# EAGLE design LVDS Raspi V0 (EAGLE 9.1.1)
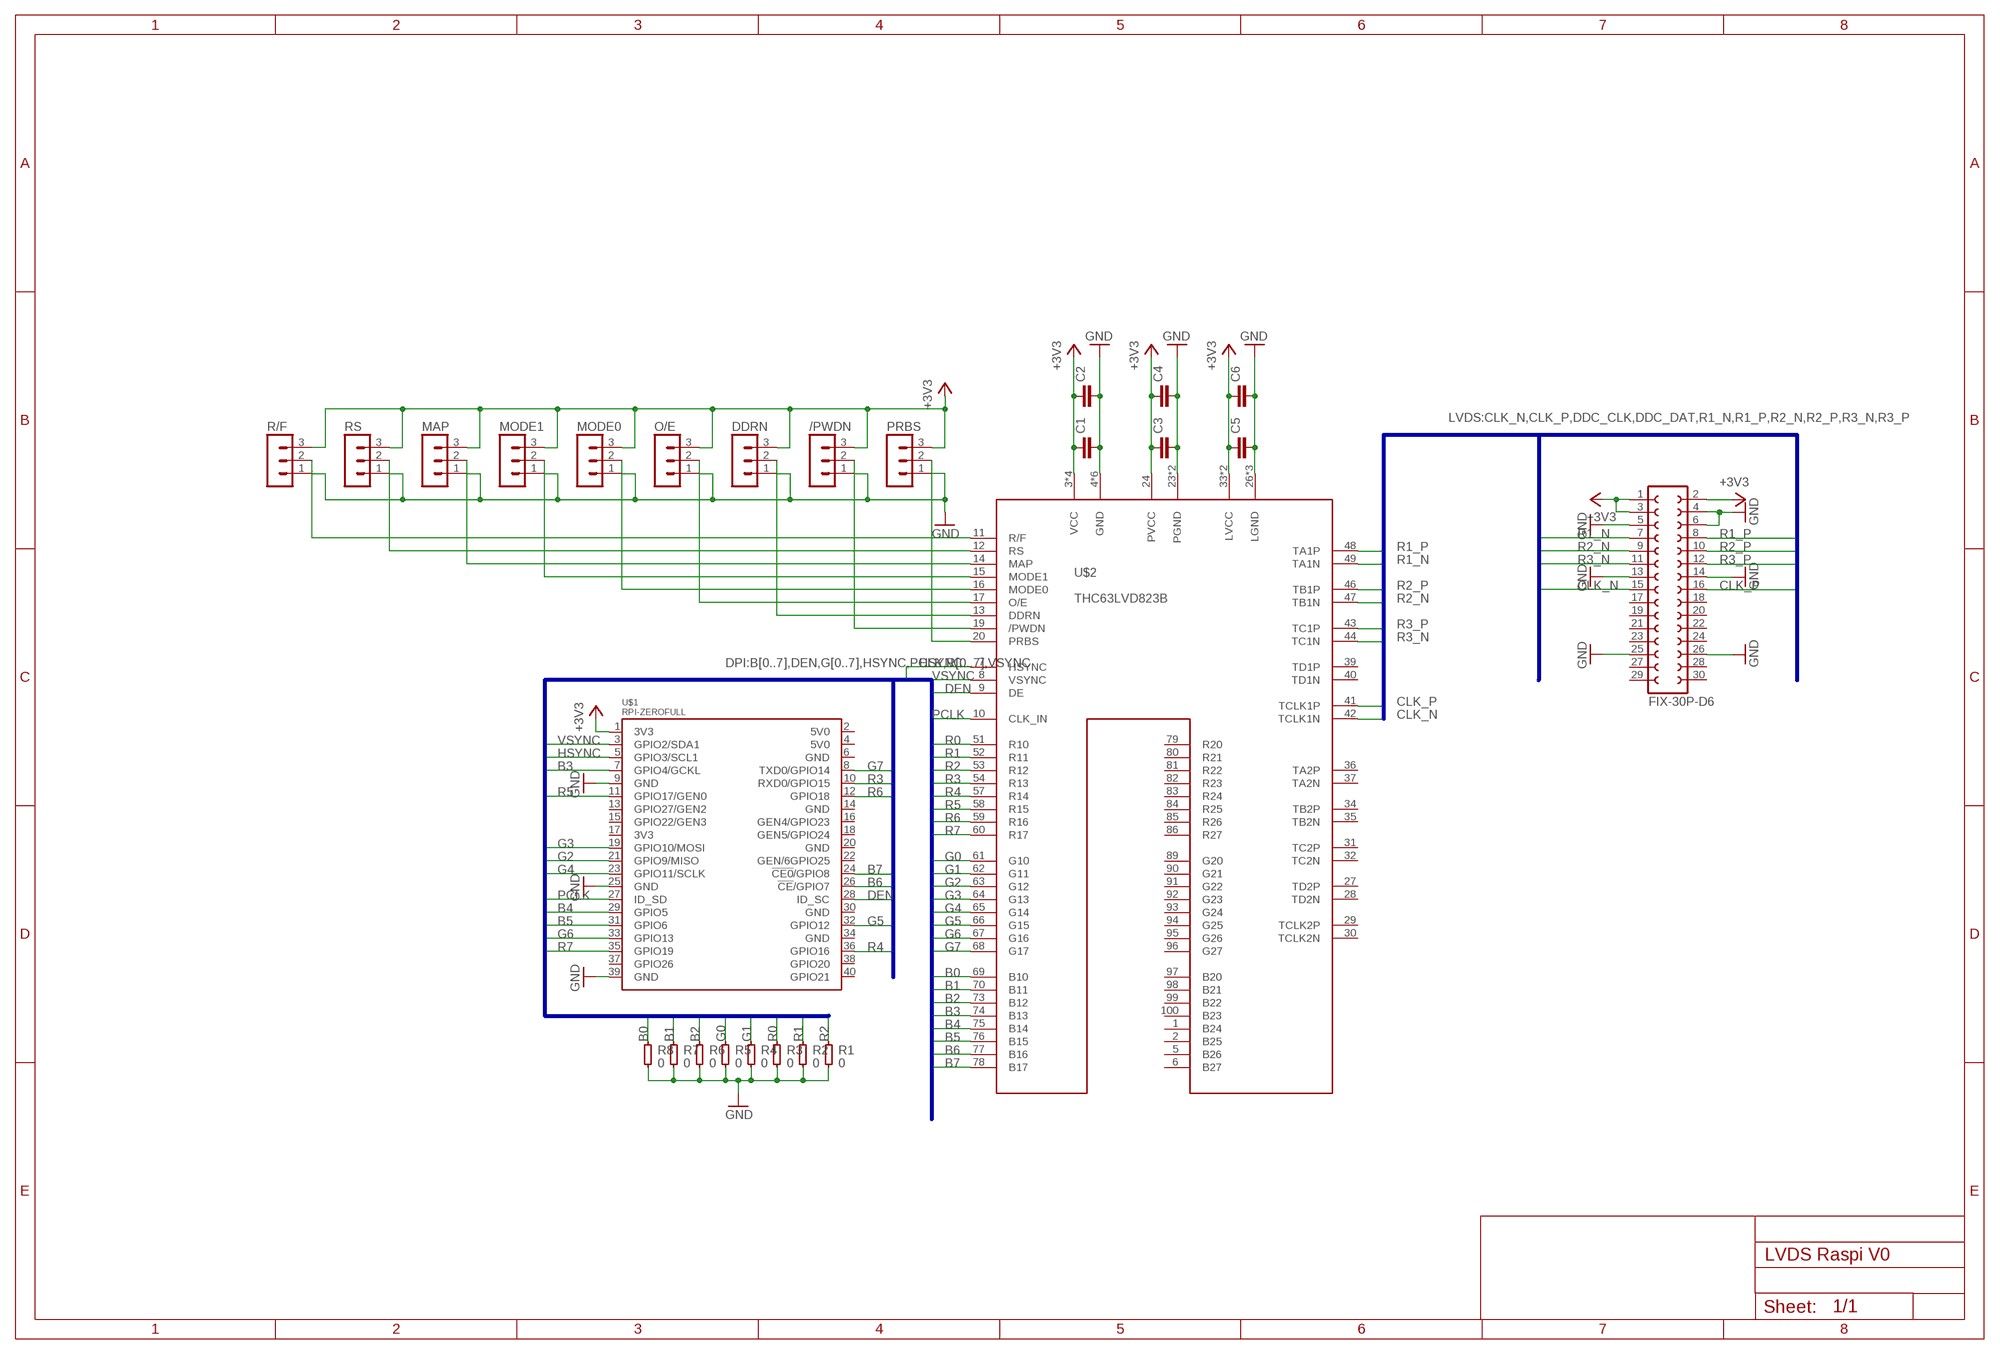
[diagram p0: schematic, sheet 1]

## Parts
/PWDN  MA03-1  [MA03-1]
C1  C0603  [C0603]
C2  C0603  [C0603]
C3  C0603  [C0603]
C4  C0603  [C0603]
C5  C0603  [C0603]
C6  C0603  [C0603]
DDRN  MA03-1  [MA03-1]
FIX-30P-D6  FE15-2  [FE15-2]
MAP  MA03-1  [MA03-1]
MODE0  MA03-1  [MA03-1]
MODE1  MA03-1  [MA03-1]
O/E  MA03-1  [MA03-1]
PRBS  MA03-1  [MA03-1]
R1  0  R0603  [R0603]
R2  0  R0603  [R0603]
R3  0  R0603  [R0603]
R4  0  R0603  [R0603]
R5  0  R0603  [R0603]
R6  0  R0603  [R0603]
R7  0  R0603  [R0603]
R8  0  R0603  [R0603]
R/F  MA03-1  [MA03-1]
RS  MA03-1  [MA03-1]
U$1  RPI-ZEROFULL  [RASP_PI_ZERO_BOARD_FULL]
U$2  THC63LVD823B  [QFP50P1600X1600X120-100]

## Nets
+3V3: /PWDN.3 C1.1 C2.1 C3.1 C4.1 C5.1 C6.1 DDRN.3 FIX-30P-D6.1 FIX-30P-D6.2 FIX-30P-D6.3 MAP.3 MODE0.3 MODE1.3 O/E.3 PRBS.3 R/F.3 RS.3 U$1.1(3V3) U$2.3(VCC) U$2.24(PVCC) U$2.33(LVCC) U$2.45(LVCC) U$2.55(VCC) U$2.71(VCC) U$2.87(VCC)
B0: R8.2 U$2.69(B10)
B1: R7.2 U$2.70(B11)
B2: R6.2 U$2.73(B12)
B3: U$1.7(GPIO4/GCKL) U$2.74(B13)
B4: U$1.29(GPIO5) U$2.75(B14)
B5: U$1.31(GPIO6) U$2.76(B15)
B6: U$1.26(!CE!/GPIO7) U$2.77(B16)
B7: U$1.24(!CE0!/GPIO8) U$2.78(B17)
CLK_N: FIX-30P-D6.15 U$2.42(TCLK1N)
CLK_P: FIX-30P-D6.16 U$2.41(TCLK1P)
DEN: U$1.28(ID_SC) U$2.9(DE)
G0: R5.2 U$2.61(G10)
G1: R4.2 U$2.62(G11)
G2: U$1.21(GPIO9/MISO) U$2.63(G12)
G3: U$1.19(GPIO10/MOSI) U$2.64(G13)
G4: U$1.23(GPIO11/SCLK) U$2.65(G14)
G5: U$1.32(GPIO12) U$2.66(G15)
G6: U$1.33(GPIO13) U$2.67(G16)
G7: U$1.8(TXD0/GPIO14) U$2.68(G17)
GND: /PWDN.1 C1.2 C2.2 C3.2 C4.2 C5.2 C6.2 DDRN.1 FIX-30P-D6.4 FIX-30P-D6.5 FIX-30P-D6.6 FIX-30P-D6.13 FIX-30P-D6.14 FIX-30P-D6.25 FIX-30P-D6.26 MAP.1 MODE0.1 MODE1.1 O/E.1 PRBS.1 R1.1 R2.1 R3.1 R4.1 R5.1 R6.1 R7.1 R8.1 R/F.1 RS.1 U$1.9(GND) U$1.25(GND) U$1.39(GND) U$2.4(GND) U$2.18(GND) U$2.21(GND) U$2.23(PGND) U$2.25(PGND) U$2.26(LGND) U$2.38(LGND) U$2.50(LGND) U$2.56(GND) U$2.72(GND) U$2.88(GND)
HSYNC: U$1.5(GPIO3/SCL1) U$2.7(HSYNC)
N$5: R/F.2 U$2.11(R/F)
N$6: RS.2 U$2.12(RS)
N$7: MAP.2 U$2.14(MAP)
N$8: MODE1.2 U$2.15(MODE1)
N$9: MODE0.2 U$2.16(MODE0)
N$10: O/E.2 U$2.17(O/E)
N$11: DDRN.2 U$2.13(DDRN)
N$12: /PWDN.2 U$2.19(/PWDN)
N$13: PRBS.2 U$2.20(PRBS)
PCLK: U$1.27(ID_SD) U$2.10(CLK_IN)
R0: R3.2 U$2.51(R10)
R1: R2.2 U$2.52(R11)
R1_N: FIX-30P-D6.7 U$2.49(TA1N)
R1_P: FIX-30P-D6.8 U$2.48(TA1P)
R2: R1.2 U$2.53(R12)
R2_N: FIX-30P-D6.9 U$2.47(TB1N)
R2_P: FIX-30P-D6.10 U$2.46(TB1P)
R3: U$1.10(RXD0/GPIO15) U$2.54(R13)
R3_N: FIX-30P-D6.11 U$2.44(TC1N)
R3_P: FIX-30P-D6.12 U$2.43(TC1P)
R4: U$1.36(GPIO16) U$2.57(R14)
R5: U$1.11(GPIO17/GEN0) U$2.58(R15)
R6: U$1.12(GPIO18) U$2.59(R16)
R7: U$1.35(GPIO19) U$2.60(R17)
VSYNC: U$1.3(GPIO2/SDA1) U$2.8(VSYNC)
Unconnected: FIX-30P-D6.17 FIX-30P-D6.18 FIX-30P-D6.19 FIX-30P-D6.20 FIX-30P-D6.21 FIX-30P-D6.22 FIX-30P-D6.23 FIX-30P-D6.24 FIX-30P-D6.27 FIX-30P-D6.28 FIX-30P-D6.29 FIX-30P-D6.30 U$1.2(5V0) U$1.4(5V0) U$1.6(GND) U$1.13(GPIO27/GEN2) U$1.14(GND) U$1.15(GPIO22/GEN3) U$1.16(GEN4/GPIO23) U$1.17(3V3) U$1.18(GEN5/GPIO24) U$1.20(GND) U$1.22(GEN/6GPIO25) U$1.30(GND) U$1.34(GND) U$1.37(GPIO26) U$1.38(GPIO20) U$1.40(GPIO21) U$2.1(B24) U$2.2(B25) U$2.5(B26) U$2.6(B27) U$2.27(TD2P) U$2.28(TD2N) U$2.29(TCLK2P) U$2.30(TCLK2N) U$2.31(TC2P) U$2.32(TC2N) U$2.34(TB2P) U$2.35(TB2N) U$2.36(TA2P) U$2.37(TA2N) U$2.39(TD1P) U$2.40(TD1N) U$2.79(R20) U$2.80(R21) U$2.81(R22) U$2.82(R23) U$2.83(R24) U$2.84(R25) U$2.85(R26) U$2.86(R27) U$2.89(G20) U$2.90(G21) U$2.91(G22) U$2.92(G23) U$2.93(G24) U$2.94(G25) U$2.95(G26) U$2.96(G27) U$2.97(B20) U$2.98(B21) U$2.99(B22) U$2.100(B23)

## Buses
DPI:B[0..7],DEN,G[0..7],HSYNC,PCLK,R[0..7],VSYNC
LVDS:CLK_N,CLK_P,DDC_CLK,DDC_DAT,R1_N,R1_P,R2_N,R2_P,R3_N,R3_P

## Library data of the parts
/PWDN DDRN MAP MODE0 MODE1 O/E PRBS R/F RS = con-lstb:MA03-1: PIN HEADER; OC_FARNELL: unknown; OC_NEWARK: unknown
C1-C6 = passive:C
FIX-30P-D6 = con-lsta:FE15-2: FEMALE HEADER; OC_FARNELL: unknown; OC_NEWARK: unknown
R1-R8 = passive:R
U$1 = rpi-zero:RPI-ZERO
U$2 = ICs:THC63LVD823B

## Board
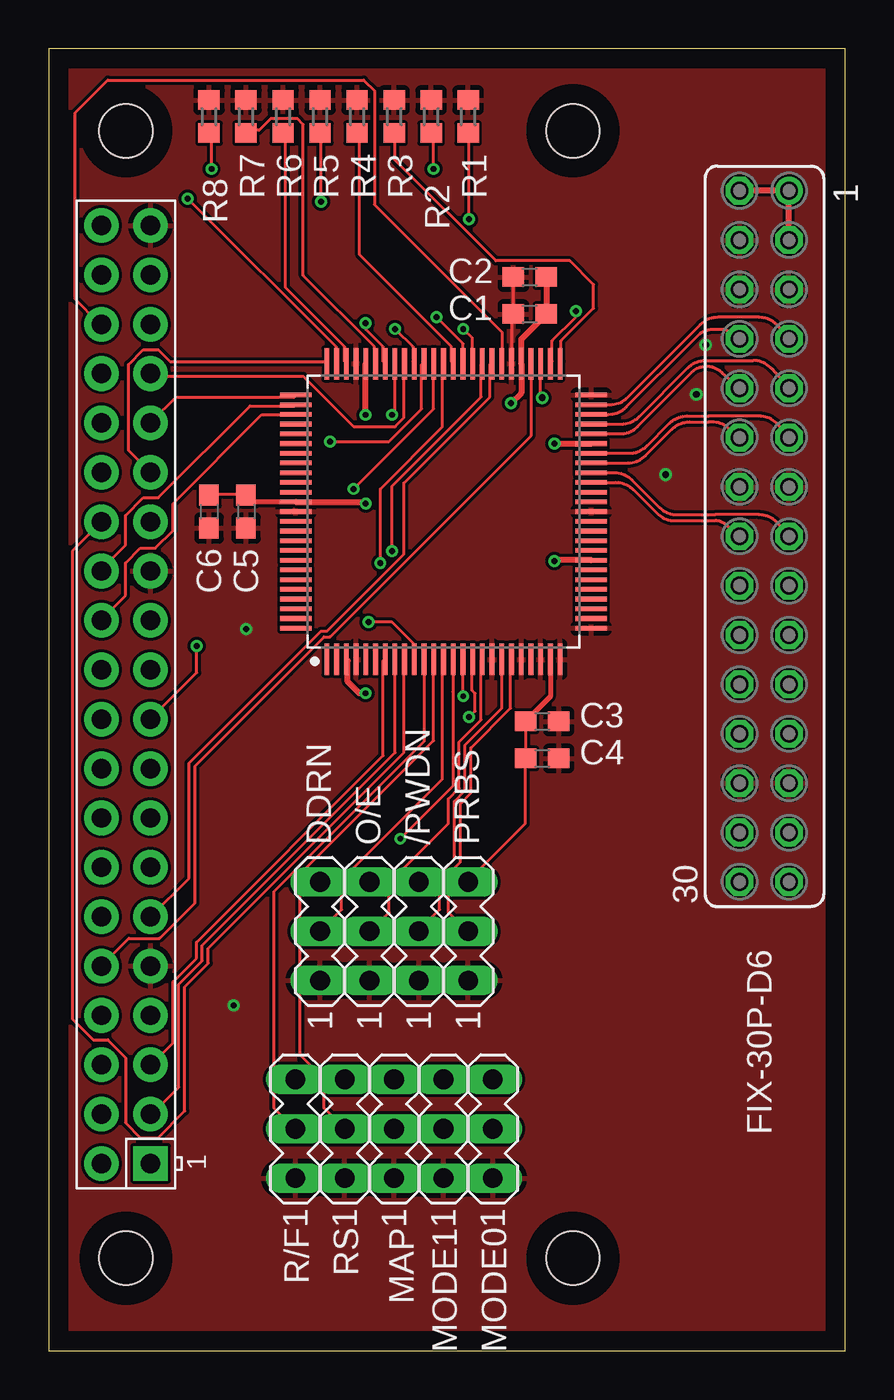
[diagram p1: board, top side]
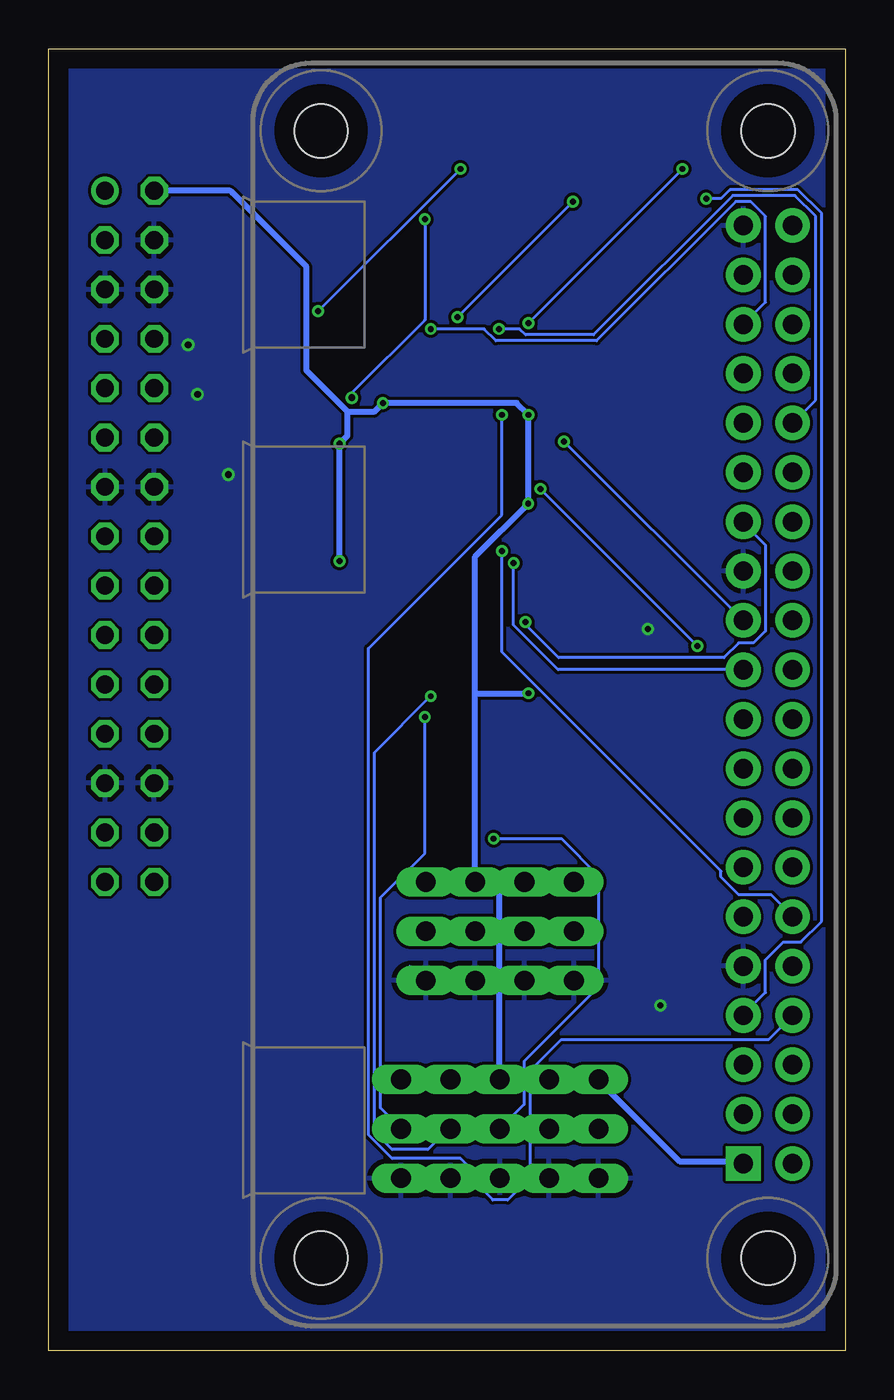
[diagram p2: board, bottom side, seen from below]

Size 41 x 67 mm. Coordinates in mm from the lower left corner, seen from the top.
Outline: 0,0 41,0 41,67 0,67 0,0
Copper layers (1*16): Top 0.035mm / dielectric 1.5mm / Bottom 0.035mm
Design rules "Seedstudio *": minimum track width 6mil, minimum drill 12mil, track to track 6mil, track to pad 6mil, pad to pad 6mil, via to via 6mil, smd to smd 0mil, copper to edge 40mil, drill to drill 10mil, minimum pad ring 10mil, minimum via ring 6mil, stop-mask expansion 2mil, vias tented up to drill 100mil, thermal gap 10mil

### Footprints (pad centres in the part's own frame; a part is rotated, then mirrored left to right if it is on the bottom)
MA03-1 = drill 1.016 long: 1 -2.54,0; 2 0,0; 3 2.54,0
C0603 = smd 1.1 x 1: 1 -0.85,0; 2 0.85,0
FE15-2 = drill 0.914: 1 -17.78,1.27 | drill 0.914 octagon: 2 -17.78,-1.27; 3 -15.24,1.27; 4 -15.24,-1.27; 5 -12.7,1.27; 6 -12.7,-1.27; 7 -10.16,1.27; 8 -10.16,-1.27; 9 -7.62,1.27; 10 -7.62,-1.27; 11 -5.08,1.27; 12 -5.08,-1.27; 13 -2.54,1.27; 14 -2.54,-1.27; 15 0,1.27; 16 0,-1.27; 17 2.54,1.27; 18 2.54,-1.27; 19 5.08,1.27; 20 5.08,-1.27; 21 7.62,1.27; 22 7.62,-1.27; 23 10.16,1.27; 24 10.16,-1.27; 25 12.7,1.27; 26 12.7,-1.27; 27 15.24,1.27; 28 15.24,-1.27; 29 17.78,1.27; 30 17.78,-1.27
R0603 = smd 1 x 1.1: 1 -0.85,0; 2 0.85,0
RASP_PI_ZERO_BOARD_FULL = drill 1 pad 1.778 square: 1 8.37,25.23 | drill 1 pad 1.778: 2 8.37,27.77; 3 10.91,25.23; 4 10.91,27.77; 5 13.45,25.23; 6 13.45,27.77; 7 15.99,25.23; 8 15.99,27.77; 9 18.53,25.23; 10 18.53,27.77; 11 21.07,25.23; 12 21.07,27.77; 13 23.61,25.23; 14 23.61,27.77; 15 26.15,25.23; 16 26.15,27.77; 17 28.69,25.23; 18 28.69,27.77; 19 31.23,25.23; 20 31.23,27.77; 21 33.77,25.23; 22 33.77,27.77; 23 36.31,25.23; 24 36.31,27.77; 25 38.85,25.23; 26 38.85,27.77; 27 41.39,25.23; 28 41.39,27.77; 29 43.93,25.23; 30 43.93,27.77; 31 46.47,25.23; 32 46.47,27.77; 33 49.01,25.23; 34 49.01,27.77; 35 51.55,25.23; 36 51.55,27.77; 37 54.09,25.23; 38 54.09,27.77; 39 56.63,25.23; 40 56.63,27.77 | hole 2.75: 3.5,3.5; 3.5,26.5; 61.5,3.5; 61.5,26.5
QFP50P1600X1600X120-100 = smd 1.612 x 0.24: 1 -7.6,6; 2 -7.6,5.5; 3 -7.6,5; 4 -7.6,4.5; 5 -7.6,4; 6 -7.6,3.5; 7 -7.6,3; 8 -7.6,2.5; 9 -7.6,2; 10 -7.6,1.5; 11 -7.6,1; 12 -7.6,0.5; 13 -7.6,0; 14 -7.6,-0.5; 15 -7.6,-1; 16 -7.6,-1.5; 17 -7.6,-2; 18 -7.6,-2.5; 19 -7.6,-3; 20 -7.6,-3.5; 21 -7.6,-4; 22 -7.6,-4.5; 23 -7.6,-5; 24 -7.6,-5.5; 25 -7.6,-6; 51 7.6,-6; 52 7.6,-5.5; 53 7.6,-5; 54 7.6,-4.5; 55 7.6,-4; 56 7.6,-3.5; 57 7.6,-3; 58 7.6,-2.5; 59 7.6,-2; 60 7.6,-1.5; 61 7.6,-1; 62 7.6,-0.5; 63 7.6,0; 64 7.6,0.5; 65 7.6,1; 66 7.6,1.5; 67 7.6,2; 68 7.6,2.5; 69 7.6,3; 70 7.6,3.5; 71 7.6,4; 72 7.6,4.5; 73 7.6,5; 74 7.6,5.5; 75 7.6,6 | smd 0.24 x 1.612: 26 -6,-7.6; 27 -5.5,-7.6; 28 -5,-7.6; 29 -4.5,-7.6; 30 -4,-7.6; 31 -3.5,-7.6; 32 -3,-7.6; 33 -2.5,-7.6; 34 -2,-7.6; 35 -1.5,-7.6; 36 -1,-7.6; 37 -0.5,-7.6; 38 0,-7.6; 39 0.5,-7.6; 40 1,-7.6; 41 1.5,-7.6; 42 2,-7.6; 43 2.5,-7.6; 44 3,-7.6; 45 3.5,-7.6; 46 4,-7.6; 47 4.5,-7.6; 48 5,-7.6; 49 5.5,-7.6; 50 6,-7.6; 76 6,7.6; 77 5.5,7.6; 78 5,7.6; 79 4.5,7.6; 80 4,7.6; 81 3.5,7.6; 82 3,7.6; 83 2.5,7.6; 84 2,7.6; 85 1.5,7.6; 86 1,7.6; 87 0.5,7.6; 88 0,7.6; 89 -0.5,7.6; 90 -1,7.6; 91 -1.5,7.6; 92 -2,7.6; 93 -2.5,7.6; 94 -3,7.6; 95 -3.5,7.6; 96 -4,7.6; 97 -4.5,7.6; 98 -5,7.6; 99 -5.5,7.6; 100 -6,7.6

### Placement (x,y rotation side)
/PWDN  19.05,21.59 90 top
C1  24.77,53.34 180 top
C2  24.77,55.24 180 top
C3  25.4,32.38 0 top
C4  25.4,30.48 0 top
C5  10.16,43.18 270 top
C6  8.26,43.18 270 top
DDRN  13.97,21.59 90 top
FIX-30P-D6  36.83,41.91 270 top
MAP  17.78,11.43 90 top
MODE0  22.86,11.43 90 top
MODE1  20.32,11.43 90 top
O/E  16.51,21.59 90 top
PRBS  21.59,21.59 90 top
R1  21.59,63.5 270 top
R2  19.68,63.5 270 top
R3  17.78,63.5 270 top
R4  15.88,63.5 270 top
R5  13.97,63.5 270 top
R6  12.06,63.5 270 top
R7  10.16,63.5 270 top
R8  8.26,63.5 270 top
R/F  12.7,11.43 90 top
RS  15.24,11.43 90 top
U$1  30.48,1.27 90 top
U$2  20.32,43.18 90 top

### Tracks (layer width: path | path; a pad name or v marks a point on that pad's centre or on a via)
+3V3  (via drill 0.3)
  Top 0.152: 28.04,40.69 U$2.33 | 17.83,14.02 MAP.3 17.68,14.02 | 20.27,14.02 MODE1.3 | 15.24,14.02 RS.3 | 24.54,30.48 24.54,32.31 C3.1 | 24.54,30.48 C4.1 24.54,30.48 | 24.54,30.48 24.54,27.13 21.64,24.23 PRBS.3 | C6.1 8.38,44.04 10.06,44.04 C5.1 | 15.39,35.51 U$2.3 | 16.31,50.75 U$2.71 | U$2.45 | 26.07,40.68 v26.04,40.64
  Top 0.254: U$2.87 10.51,43.68 C5.1 | U$2.24 25.82,33.66 C3.1
  Top 0.305: 20.27,14.02 17.83,14.02 | 15.24,14.02 17.68,14.02 | 15.39,35.51 15.39,34.43 15.99,33.83 v16.31,33.83 | v16.31,48.16 16.31,50.75 | v26.04,46.67 U$2.45 | U$2.33 26.07,40.68 | C2.1 C1.1 24.32,52.05 U$2.55 24.32,49.29 v23.8,48.77 | FIX-30P-D6.3 FIX-30P-D6.1 FIX-30P-D6.2 | U$2.87 16.23,43.68 v16.32,43.59
  Bottom 0.152: 22.86,14.02 MODE0.3 | 20.42,14.02 MODE1.3 | 12.8,14.02 R/F.3 12.65,13.87 | RS.3 15.24,14.02 | 5.33,9.75 U$1.1 | 14.02,24.23 DDRN.3 | 16.46,24.23 O/E.3 16.61,24.23 | 19.05,24.23 /PWDN.3 | 19.05,24.23 /PWDN.3 | 21.49,24.23 PRBS.3 | 19.05,24.23 /PWDN.3 | 17.83,14.02 MAP.3 | 31.54,59.58 31.55,59.59 | 25.6,48.31 25.64,48.34
  Bottom 0.305: 20.42,14.02 22.86,14.02 | 15.24,14.02 12.8,14.02 | 5.33,9.75 8.53,9.75 12.65,13.87 | 16.46,24.23 14.02,24.23 | 19.05,24.23 19.05,33.83 | 19.05,33.83 19.05,40.86 v16.32,43.59 16.31,43.57 v16.31,48.16 16.92,48.77 v23.8,48.77 24.26,48.31 25.6,48.31 | 19.05,33.83 v16.31,33.83 | 19.05,24.23 17.83,24.23 | 17.83,24.23 16.61,24.23 | 19.05,24.23 21.49,24.23 | 17.83,24.23 17.83,14.02 | v26.04,40.64 v26.04,46.67 25.64,47.07 25.64,48.34 27.74,50.44 27.74,55.78 31.54,59.58 31.65,59.69 FIX-30P-D6.2
B0  (via drill 0.3)
  Top 0.152: v8.38,60.81 8.38,62.64 R8.2 | v16.31,52.88 16.31,52.58 17.22,51.66 17.22,50.9 U$2.69
  Bottom 0.152: v16.31,52.88 v8.38,60.81
B1
  Top 0.152: R7.2 10.21,62.79 10.82,62.79 11.43,63.4 12.8,63.4 13.11,63.09 13.11,55.32 16.76,51.66 16.76,50.9 U$2.70
B2
  Top 0.152: R6.2 12.19,62.64 12.19,54.71 15.24,51.66 15.24,50.9 U$2.73
B3  (via drill 0.3)
  Top 0.152: v7.16,59.28 14.78,51.66 14.78,50.9 U$2.74
  Bottom 0.152: v7.16,59.28 6.4,59.28 5.94,59.74 2.44,59.74 1.22,58.52 1.22,22.1 2.29,21.03 3.2,21.03 4.12,20.12 4.12,18.44 5.18,17.37 U$1.7
B4
  Top 0.152: U$2.75 14.33,50.9 6.25,50.9 5.64,51.51 4.88,51.51 4.12,50.75 4.12,46.33 5.18,45.26 U$1.29
B5
  Top 0.152: U$2.76 12.65,49.07 6.55,49.07 5.33,47.85 U$1.31
B6
  Top 0.152: U$2.77 12.65,48.62 10.36,48.62 5.64,43.89 4.88,43.89 3.96,42.98 3.96,41.45 2.74,40.23 U$1.26
B7
  Top 0.152: U$2.78 12.65,48.16 10.97,48.16 6.4,43.59 6.4,42.22 5.49,41.3 4.72,41.3 3.96,40.54 3.96,38.86 2.74,37.64 U$1.24
CLK_N
  Top 0.152: FIX-30P-D6.15 37.53,42.57 arc49 36.57,43.02 34.29,43.02 32.34,43.02 arc-45 31.44,43.39 30.02,44.81 arc45 29.12,45.18 U$2.42
CLK_P
  Top 0.152: FIX-30P-D6.16 34.85,42.51 arc40 34.29,42.71 32.21,42.71 arc-45 31.32,43.08 30.09,44.31 arc45 29.19,44.68 U$2.41
DEN
  Top 0.152: U$2.9 18.29,35.51 18.29,30.79 8.22,20.71 8.22,19.94 7.01,18.73 7.01,12.34 5.64,10.97 4.72,10.97 3.96,11.73 3.96,15.09 3.05,16 2.29,16 1.22,17.07 1.22,41.15 2.59,42.52 U$1.28
G0  (via drill 0.3)
  Top 0.152: v14.02,59.13 14.02,62.64 R5.2 | v19.96,53.19 21.34,51.82 21.34,50.9 U$2.61
  Bottom 0.152: v19.96,53.19 v14.02,59.13
G1
  Top 0.152: R4.2 16,62.64 16,56.39 20.73,51.66 20.73,50.9 U$2.62
G2  (via drill 0.3)
  Top 0.152: v17.07,40.54 17.07,44.35 20.27,47.55 20.27,50.75 U$2.63
  Bottom 0.152: v17.07,40.54 17.07,37.34 14.78,35.05 5.33,35.05 U$1.21
G3  (via drill 0.3)
  Top 0.152: v15.7,44.35 19.81,48.46 19.81,50.75 U$2.64 | v7.62,36.27 7.62,34.9 5.33,32.61 U$1.19
  Bottom 0.152: v7.62,36.27 v15.7,44.35
G4  (via drill 0.3)
  Top 0.152: v14.48,46.79 17.53,46.79 19.2,48.46 19.2,50.75 U$2.65
  Bottom 0.152: v14.48,46.79 5.33,37.64 U$1.23
G5  (via drill 0.3)
  Top 0.152: v17.83,52.58 18.75,51.66 18.75,50.9 U$2.66
  Bottom 0.152: v17.83,52.58 16.76,52.58 16.46,52.27 12.95,52.27 5.79,59.44 2.59,59.44 1.52,58.37 1.52,48.92 2.59,47.85 U$1.32
G6
  Top 0.152: U$2.67 18.29,50.75 18.29,48.01 17.83,47.55 15.7,47.55 13.11,50.14 5.33,50.14 U$1.33
G7  (via drill 0.3)
  Top 0.152: v17.68,48.16 17.83,48.31 17.83,50.75 U$2.68
  Bottom 0.152: v17.68,48.16 17.68,43 24.54,36.14 24.54,11.12 23.32,9.91 19.81,9.91 18.9,8.99 18.9,8.53 18.14,7.77 17.37,7.77 16.23,8.91 16.23,14.4 14.63,16 3.96,16 2.74,17.22 U$1.8
GND  (via drill 0.3, 0.35)
  Top 0.152: U$2.56 23.82,53.24 C1.2 C2.2
  Bottom 0.152: 22.23,19.68 22.44,19.78 22.23,19.68
  other vias: 9.53,17.78 10.16,37.15 33.81,51.75 33.34,49.21 31.75,45.09
  pour Top: 0,0 41,0 41,67 0,67
  pour Bottom: 0,0 41,0 41,66 41,67 0,67
HSYNC
  Top 0.152: U$2.7 17.22,35.51 17.22,30.63 7.61,21.02 7.61,20.19 6.4,18.99 6.4,15.85 5.33,14.78 U$1.5
N$5
  Top 0.152: R/F.2 12.65,11.43 11.58,12.5 11.58,23.62 19.32,31.36 U$2.11
N$6
  Top 0.152: RS.2 14.17,12.5 14.17,14.02 12.95,15.24 12.95,24.54 19.81,31.39 19.81,35.51 U$2.12
N$7  (via drill 0.3)
  Top 0.152: U$2.14 20.82,33.92 20.8,33.9 20.8,29.06 v18.1,26.35
  Bottom 0.152: v18.1,26.35 14.61,26.35 12.7,24.45 12.7,18.73 16.54,14.9 16.54,12.68 MAP.2
N$8  (via drill 0.3)
  Top 0.152: v21.34,33.68 21.34,35.51 U$2.15
  Bottom 0.152: v21.34,33.68 24.23,30.79 24.23,11.28 23.32,10.36 21.49,10.36 20.42,11.43 MODE1.2
N$9  (via drill 0.3)
  Top 0.152: v21.64,32.61 21.95,32.92 21.95,33.83 21.79,33.98 21.79,35.51 U$2.16
  Bottom 0.152: v21.64,32.61 21.64,25.6 23.93,23.32 23.93,12.5 MODE0.2
N$10
  Top 0.152: U$2.17 22.25,35.51 22.25,32.46 21.12,31.34 21.12,28.95 20.57,28.4 20.57,27.13 17.53,24.08 17.53,22.55 16.61,21.64 O/E.2
N$11
  Top 0.152: U$2.13 20.27,35.51 20.27,29.41 15.09,24.23 15.09,22.71 14.02,21.64 DDRN.2
N$12
  Top 0.152: U$2.19 23.32,35.51 23.32,33.07 21.43,31.18 21.43,28.82 20.88,28.27 20.88,25.3 20.12,24.54 20.12,22.71 19.05,21.64 /PWDN.2
N$13
  Top 0.152: U$2.20 23.77,35.51 23.77,33.07 21.73,31.03 21.73,28.7 21.18,28.14 21.18,25.15 20.57,24.54 20.57,22.55 21.49,21.64 PRBS.2
PCLK  (via drill 0.3)
  Top 0.152: v16.46,37.49 17.68,37.49 18.82,36.35 U$2.10
  Bottom 0.152: U$1.27 5.18,42.52 4.12,41.45 4.12,37.03 4.72,36.42 5.49,36.42 6.25,35.66 14.76,35.66 16.46,37.36 v16.46,37.49
R0
  Top 0.152: R3.2 17.83,62.64 17.83,61.27 23.01,56.08 26.82,56.08 28.04,54.86 28.04,53.65 26.36,51.97 26.36,50.9 U$2.51
R1  (via drill 0.3)
  Top 0.152: v19.81,60.81 19.81,62.64 R2.2 | v27.13,53.49 27.13,53.19 25.91,51.97 25.91,50.9 U$2.52
  Bottom 0.152: v27.13,53.49 v19.81,60.81
R1_N
  Top 0.152: FIX-30P-D6.7 37.53,52.73 arc49 36.57,53.17 34.44,53.17 arc45 33.54,52.8 32.91,52.18 29.79,49.05 arc-45 28.89,48.68 U$2.49
R1_P
  Top 0.152: FIX-30P-D6.8 35.34,52.26 arc40 34.52,52.55 34.24,52.55 arc45 33.35,52.18 33.13,51.96 29.72,48.55 arc-45 28.82,48.18 U$2.48
R2  (via drill 0.3, 0.35)
  Top 0.152: v21.64,58.22 21.64,62.64 R1.2 | 25.3,50.75 25.3,50.76 | 25.3,50.76 U$2.53 | v25.4,49.04 25.3,49.13 25.3,50.76
  Bottom 0.152: v21.64,58.22 21.64,53.03 25.4,49.28 v25.4,49.04
R2_N
  Top 0.152: FIX-30P-D6.9 37.21,50.53 arc48 36.26,50.95 33.8,50.95 arc45 32.9,50.58 30.37,48.05 arc-45 29.48,47.68 U$2.47
R2_P
  Top 0.152: FIX-30P-D6.10 34.65,50.33 arc41 33.81,50.65 arc45 33.11,50.36 30.3,47.55 arc-45 29.41,47.18 U$2.46
R3
  Top 0.152: U$2.54 24.84,50.75 24.84,47.09 14.48,36.73 14.17,36.73 7.53,30.09 7.53,23.04 5.71,21.22 4.13,21.22 U$1.10
R3_N
  Top 0.152: FIX-30P-D6.11 37.53,47.65 arc49 36.57,48.09 33.97,48.09 32.85,48.09 arc45 31.95,47.72 30.78,46.55 arc-45 29.88,46.18 U$2.44
R3_P
  Top 0.152: FIX-30P-D6.12 34.96,47.49 arc40 34.15,47.79 33.97,47.79 32.97,47.79 arc45 32.08,47.42 30.71,46.05 arc-45 29.81,45.68 U$2.43
R4
  Top 0.152: U$2.57 23.32,50.9 23.32,52.43 16.76,58.98 16.76,64.83 16.22,65.38 3.05,65.38 1.37,63.7 1.37,54.1 2.59,52.88 U$1.36
R5
  Top 0.152: U$2.58 22.71,50.75 22.71,49.07 18.29,44.65 18.29,41 14.33,37.03 14.02,37.03 7.23,30.24 7.23,24.32 U$1.11
R6  (via drill 0.3)
  Top 0.152: v17.68,41.15 17.68,44.5 22.25,49.07 22.25,50.75 U$2.59
  Bottom 0.152: v17.68,41.15 17.68,35.97 6.4,24.69 6.4,24.38 5.49,23.47 3.81,23.47 2.74,22.4 U$1.12
R7  (via drill 0.3)
  Top 0.152: v21.34,52.58 21.79,52.12 21.79,50.9 U$2.60
  Bottom 0.152: v21.34,52.58 18.59,52.58 17.98,51.97 12.8,51.97 5.64,59.13 4.88,59.13 4.12,58.37 4.12,53.95 5.18,52.88 U$1.35
VSYNC
  Top 0.152: U$2.8 17.83,35.51 17.83,30.79 7.91,20.87 7.91,20.07 6.71,18.86 6.71,13.56 5.33,12.19 U$1.3

### Text on the board
tDocu: LVDS-Shield 1.0 / Philip Caroli